# Altium schematic sheet Buck_5_12.SchDoc
size A; SheetNumber: 1; SheetTotal: 1
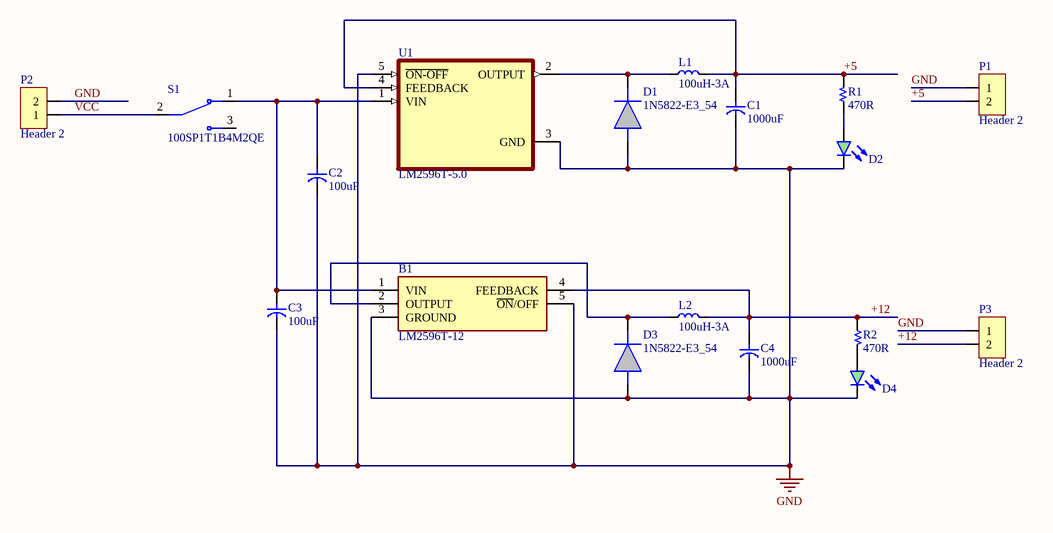
[diagram p0: Buck_5_12.SchDoc]

## Parts
B1  LM2596T-12  [TO170P470X1028X2142-5P]
C1  1000uF  [CAP/D80/H125/LS35]
C2  100uF  [CAP/D80/H125/LS35]
C3  100uF  [CAP/D80/H125/LS35]
C4  1000uF  [CAP/D80/H125/LS35]
D1  1N5822-E3_54  [DIOAD2855W132L835D505]
D2  LED GREEN  [LED 10MM - GREEN]  (value not drawn)
D3  1N5822-E3_54  [DIOAD2855W132L835D505]
D4  LED GREEN  [LED 10MM - GREEN]  (value not drawn)
L1  100uH-3A  [R 1/4W]
L2  100uH-3A  [R 1/4W]
P1  Header 2  [HDR/Terminal/2]
P2  Header 2  [HDR/Terminal/2]
P3  Header 2  [HDR/Terminal/2]
R1  470R  [R 1/4W/300]
R2  470R  [R 1/4W/300]
S1  100SP1T1B4M2QE  [SW_100SP1T1B4M2QE]
U1  LM2596T-5.0  [TO170P1016X470X2092-5]

## Nets
GND: B1.3(GROUND) B1.5(~{ON}/OFF) C1.2 C2.2 C3.2 C4.2 D1.1(A) D2.2(K) D3.1(A) D4.2(K) P1.1 P2.2 P3.1 U1.3(GND) U1.5(~{ON-OFF})
+5: C1.1 L1.2 P1.2 R1.2 U1.4(FEEDBACK)
+12: B1.4(FEEDBACK) C4.1 L2.2 P3.2 R2.1
VCC: P2.1 S1.2
NetB1_1: B1.1(VIN) C2.1 C3.1 S1.1 U1.1(VIN)
NetB1_2: B1.2(OUTPUT) D3.2(K) L2.1
NetD1_2: D1.2(K) L1.1 U1.2(OUTPUT)
NetD2_1: D2.1(A) R1.1
NetD4_1: D4.1(A) R2.2

Not connected (* = marked no-connect by the designer): S1 3

## Library data of the parts
B1 = LM2596T-12: IC, STEP-DOWN VOLTAGE REGULATOR; Manufacturer_Name: Texas Instruments; Geometry.Height: 4.7mm; Manufacturer_Part_Number: LM2596T-12; Mouser Part Number: 926-LM2596T-12; Mouser Price/Stock: https://www.mouser.co.uk/ProductDetail/Texas-Instruments/LM2596T-12?qs=X1J7HmVL2ZEBljJkxhFhyw%3D%3D; Arrow Part Number: *; Arrow Price/Stock: *; Datasheet Link: http://www.ti.com/lit/ds/symlink/lm2596.pdf
C1-C4 = Capacitor: Capacitor pol
D1 D3 = 1N5822-E3_54: VISHAY - 1N5822-E3/54 - Schottky Rectifier, 40 V, 3 A, Single, DO-201AD, 2 Pins, 525 mV; Manufacturer_Name: Vishay; Manufacturer_Part_Number: 1N5822-E3/54; Mouser Part Number: 625-1N5822-E3; Mouser Price/Stock: https://www.mouser.co.uk/ProductDetail/Vishay-General-Semiconductor/1N5822-E3-54?qs=7w0fSgRKp92xXX1kfLSISA%3D%3D; Arrow Part Number: 1N5822-E3/54; Arrow Price/Stock: https://www.arrow.com/en/products/1n5822-e354/vishay?utm_currency=USD&region=nac; Datasheet Link: https://4donline.ihs.com/images/VipMasterIC/IC/VISH/VISH-S-A0001809980/VISH-S-A0001809988-1.pdf?hkey=6D3A4C79FDBF58556ACFDE234799DDF0
D2 D4 = LED GREEN: Typical LED 3-pin 2-color
L1 L2 = Inductor
P1-P3 = Header 2: Header, 2-Pin
R1 R2 = Resistor
S1 = 100SP1T1B4M2QE: Toggle Switch SPDT Through Hole; Package: None; Price: None; Value: *; MP: 100SP1T1B4M2QE; Availability: Unavailable
U1 = LM2596T-5.0: SIMPLE SWITCHERÂ® 4.5V to 40V, 3A Low Component Count Step-Down Regulator 5-TO-220; MF: Texas Instruments; SnapEDA_Link: https://www.snapeda.com/parts/LM2596T-5.0/Texas+Instruments/view-part/?ref=snap; Package: TO-220-5 Texas Instruments; Value: *; MP: LM2596T-5.0; Check_prices: https://www.snapeda.com/parts/LM2596T-5.0/Texas+Instruments/view-part/?ref=eda